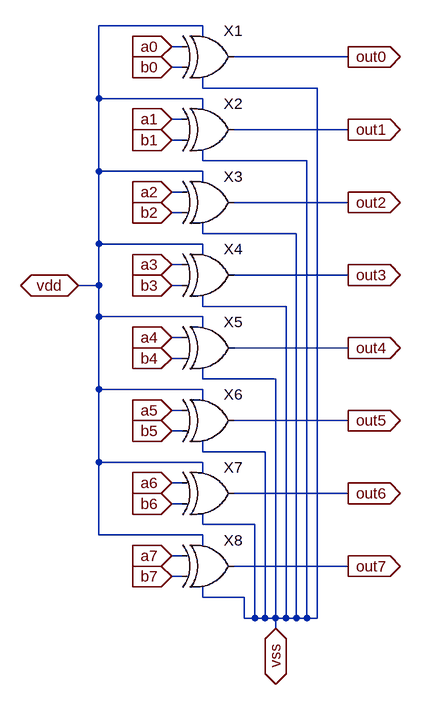
[diagram p0: schematic 8_bit_xor.asc]
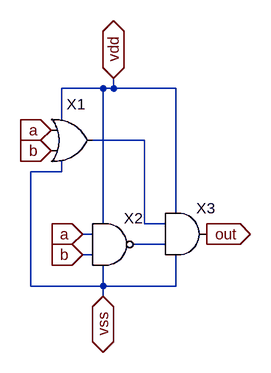
[diagram p1: sub-circuit xor.asc]
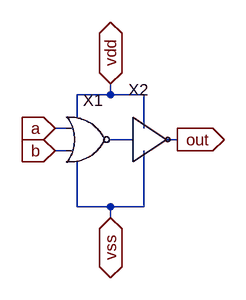
[diagram p2: sub-circuit or.asc]
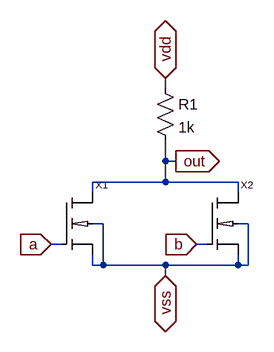
[diagram p3: sub-circuit nor.asc]
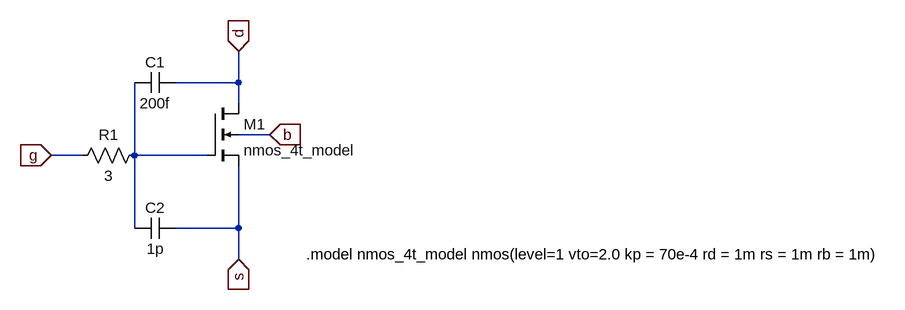
[diagram p4: sub-circuit nmos_4t.asc]
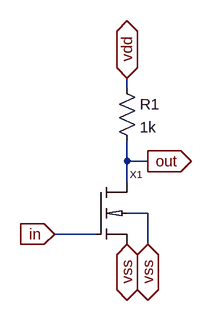
[diagram p5: sub-circuit not.asc]
8_bit_xor.asc, the LTspice schematic file:
Version 4
SHEET 1 880 992
WIRE 224 -32 64 -32
WIRE 224 -16 224 -32
WIRE 192 0 176 0
WIRE 448 16 272 16
WIRE 192 32 176 32
WIRE 224 64 224 48
WIRE 400 64 224 64
WIRE 64 80 64 -32
WIRE 224 80 64 80
WIRE 224 96 224 80
WIRE 192 112 176 112
WIRE 448 128 272 128
WIRE 192 144 176 144
WIRE 224 176 224 160
WIRE 384 176 224 176
WIRE 64 192 64 80
WIRE 224 192 64 192
WIRE 224 208 224 192
WIRE 192 224 176 224
WIRE 448 240 272 240
WIRE 192 256 176 256
WIRE 224 288 224 272
WIRE 368 288 224 288
WIRE 64 304 64 192
WIRE 224 304 64 304
WIRE 224 320 224 304
WIRE 192 336 176 336
WIRE 448 352 272 352
WIRE 64 368 64 304
WIRE 64 368 32 368
WIRE 192 368 176 368
WIRE 224 400 224 384
WIRE 352 400 224 400
WIRE 64 416 64 368
WIRE 224 416 64 416
WIRE 224 432 224 416
WIRE 192 448 176 448
WIRE 448 464 272 464
WIRE 192 480 176 480
WIRE 224 512 224 496
WIRE 336 512 224 512
WIRE 64 528 64 416
WIRE 224 528 64 528
WIRE 224 544 224 528
WIRE 192 560 176 560
WIRE 448 576 272 576
WIRE 192 592 176 592
WIRE 224 624 224 608
WIRE 320 624 224 624
WIRE 64 640 64 528
WIRE 224 640 64 640
WIRE 224 656 224 640
WIRE 192 672 176 672
WIRE 448 688 272 688
WIRE 192 704 176 704
WIRE 224 736 224 720
WIRE 304 736 224 736
WIRE 64 752 64 640
WIRE 224 752 64 752
WIRE 224 768 224 752
WIRE 192 784 176 784
WIRE 448 800 272 800
WIRE 192 816 176 816
WIRE 224 848 224 832
WIRE 288 848 224 848
WIRE 288 880 288 848
WIRE 304 880 304 736
WIRE 304 880 288 880
WIRE 320 880 320 624
WIRE 320 880 304 880
WIRE 336 880 336 512
WIRE 336 880 320 880
WIRE 352 880 352 400
WIRE 352 880 336 880
WIRE 368 880 368 288
WIRE 368 880 352 880
WIRE 384 880 384 176
WIRE 384 880 368 880
WIRE 400 880 400 64
WIRE 400 880 384 880
WIRE 336 896 336 880
FLAG 176 0 a0
IOPIN 176 0 In
FLAG 176 32 b0
IOPIN 176 32 In
FLAG 176 112 a1
IOPIN 176 112 In
FLAG 176 144 b1
IOPIN 176 144 In
FLAG 176 256 b2
IOPIN 176 256 In
FLAG 176 224 a2
IOPIN 176 224 In
FLAG 176 368 b3
IOPIN 176 368 In
FLAG 176 336 a3
IOPIN 176 336 In
FLAG 176 480 b4
IOPIN 176 480 In
FLAG 176 448 a4
IOPIN 176 448 In
FLAG 176 592 b5
IOPIN 176 592 In
FLAG 176 560 a5
IOPIN 176 560 In
FLAG 176 704 b6
IOPIN 176 704 In
FLAG 176 672 a6
IOPIN 176 672 In
FLAG 176 816 b7
IOPIN 176 816 In
FLAG 176 784 a7
IOPIN 176 784 In
FLAG 336 896 vss
IOPIN 336 896 BiDir
FLAG 32 368 vdd
IOPIN 32 368 BiDir
FLAG 448 16 out0
IOPIN 448 16 Out
FLAG 448 128 out1
IOPIN 448 128 Out
FLAG 448 240 out2
IOPIN 448 240 Out
FLAG 448 352 out3
IOPIN 448 352 Out
FLAG 448 464 out4
IOPIN 448 464 Out
FLAG 448 576 out5
IOPIN 448 576 Out
FLAG 448 688 out6
IOPIN 448 688 Out
FLAG 448 800 out7
IOPIN 448 800 Out
SYMBOL xor 240 -48 R0
SYMATTR InstName X1
SYMBOL xor 240 64 R0
SYMATTR InstName X2
SYMBOL xor 240 176 R0
SYMATTR InstName X3
SYMBOL xor 240 288 R0
SYMATTR InstName X4
SYMBOL xor 240 400 R0
SYMATTR InstName X5
SYMBOL xor 240 512 R0
SYMATTR InstName X6
SYMBOL xor 240 624 R0
SYMATTR InstName X7
SYMBOL xor 240 736 R0
SYMATTR InstName X8

xor.asc, the sub-circuit schematic file:
Version 4
SHEET 1 880 680
WIRE 208 -144 144 -144
WIRE 224 -144 224 -160
WIRE 224 -144 208 -144
WIRE 320 -144 224 -144
WIRE 144 -96 144 -144
WIRE 272 -64 192 -64
WIRE 144 -16 144 -32
WIRE 144 -16 96 -16
WIRE 320 48 320 -144
WIRE 208 64 208 -144
WIRE 272 64 272 -64
WIRE 304 64 272 64
WIRE 192 80 176 80
WIRE 304 96 256 96
WIRE 192 112 176 112
WIRE 96 160 96 -16
WIRE 208 160 208 128
WIRE 208 160 96 160
WIRE 320 160 320 112
WIRE 320 160 208 160
WIRE 208 176 208 160
FLAG 128 -80 a
IOPIN 128 -80 In
FLAG 176 80 a
IOPIN 176 80 In
FLAG 176 112 b
IOPIN 176 112 In
FLAG 128 -48 b
IOPIN 128 -48 In
FLAG 368 80 out
IOPIN 368 80 Out
FLAG 224 -160 vdd
IOPIN 224 -160 BiDir
FLAG 208 176 vss
IOPIN 208 176 BiDir
SYMBOL nand 224 32 R0
SYMATTR InstName X2
SYMBOL or 160 -128 R0
SYMATTR InstName X1
SYMBOL and 336 16 R0
SYMATTR InstName X3

or.asc, the sub-circuit schematic file:
Version 4
SHEET 1 880 680
WIRE 176 80 176 64
WIRE 176 80 128 80
WIRE 224 80 176 80
WIRE 128 112 128 80
WIRE 112 128 96 128
WIRE 224 128 224 80
WIRE 208 144 176 144
WIRE 272 144 256 144
WIRE 112 160 96 160
WIRE 128 240 128 176
WIRE 176 240 128 240
WIRE 224 240 224 160
WIRE 224 240 176 240
WIRE 176 256 176 240
FLAG 272 144 out
IOPIN 272 144 Out
FLAG 176 64 vdd
IOPIN 176 64 BiDir
FLAG 176 256 vss
IOPIN 176 256 BiDir
FLAG 96 128 a
IOPIN 96 128 In
FLAG 96 160 b
IOPIN 96 160 In
SYMBOL nor 144 80 R0
SYMATTR InstName X1
SYMBOL not 208 144 R0
SYMATTR InstName X2
SYMATTR Value ""

nor.asc, the sub-circuit schematic file:
Version 4
SHEET 1 880 680
WIRE 240 48 240 32
WIRE 240 160 240 128
WIRE 256 160 240 160
WIRE 240 192 240 160
WIRE 240 192 128 192
WIRE 352 192 240 192
WIRE 128 208 128 192
WIRE 352 208 352 192
WIRE 144 256 128 256
WIRE 368 256 352 256
WIRE 80 288 64 288
WIRE 304 288 288 288
WIRE 128 320 128 304
WIRE 144 320 144 256
WIRE 144 320 128 320
WIRE 240 320 144 320
WIRE 352 320 352 304
WIRE 352 320 240 320
WIRE 368 320 368 256
WIRE 368 320 352 320
WIRE 240 336 240 320
FLAG 240 32 vdd
IOPIN 240 32 BiDir
FLAG 240 336 vss
IOPIN 240 336 BiDir
FLAG 256 160 out
IOPIN 256 160 Out
FLAG 288 288 b
IOPIN 288 288 In
FLAG 64 288 a
IOPIN 64 288 In
SYMBOL res 224 32 R0
SYMATTR InstName R1
SYMATTR Value 1k
SYMBOL nmos_4t 80 208 R0
SYMATTR InstName X1
SYMBOL nmos_4t 304 208 R0
SYMATTR InstName X2

nmos_4t.asc, the sub-circuit schematic file:
Version 4
SHEET 1 880 680
WIRE -288 -224 -288 -272
WIRE -288 -224 -384 -224
WIRE -288 -192 -288 -224
WIRE -240 -144 -288 -144
WIRE -528 -112 -576 -112
WIRE -448 -112 -448 -224
WIRE -336 -112 -448 -112
WIRE -448 0 -448 -112
WIRE -288 0 -288 -96
WIRE -288 0 -384 0
WIRE -288 48 -288 0
FLAG -576 -112 g
IOPIN -576 -112 In
FLAG -288 -272 d
IOPIN -288 -272 In
FLAG -288 48 s
IOPIN -288 48 In
FLAG -240 -144 b
IOPIN -240 -144 In
SYMBOL nmos4 -336 -192 R0
SYMATTR InstName M1
SYMATTR Value nmos_4t_model
SYMBOL cap -384 -240 R90
WINDOW 0 0 32 VBottom 2
WINDOW 3 32 32 VTop 2
SYMATTR InstName C1
SYMATTR Value 200f
SYMBOL cap -384 -16 R90
WINDOW 0 0 32 VBottom 2
WINDOW 3 32 32 VTop 2
SYMATTR InstName C2
SYMATTR Value 1p
SYMBOL res -432 -128 R90
WINDOW 0 0 56 VBottom 2
WINDOW 3 32 56 VTop 2
SYMATTR InstName R1
SYMATTR Value 3
TEXT -184 40 Left 2 !.model nmos_4t_model nmos(level=1 vto=2.0 kp = 70e-4 rd = 1m rs = 1m rb = 1m)

not.asc, the sub-circuit schematic file:
Version 4
SHEET 1 880 680
WIRE 176 -96 176 -112
WIRE 176 16 176 -16
WIRE 208 16 176 16
WIRE 176 48 176 16
WIRE 208 96 176 96
WIRE 128 128 64 128
WIRE 208 144 208 96
FLAG 64 128 in
IOPIN 64 128 In
FLAG 176 144 vss
IOPIN 176 144 BiDir
FLAG 176 -112 vdd
IOPIN 176 -112 BiDir
FLAG 208 16 out
IOPIN 208 16 Out
FLAG 208 144 vss
IOPIN 208 144 BiDir
SYMBOL res 160 -112 R0
SYMATTR InstName R1
SYMATTR Value 1k
SYMBOL nmos_4t 128 48 R0
SYMATTR InstName X1

The netlist it stands for:
* 8_bit_xor.asc
XX1 a0 b0 vdd vss out0 xor
XX2 a1 b1 vdd vss out1 xor
XX3 a2 b2 vdd vss out2 xor
XX4 a3 b3 vdd vss out3 xor
XX5 a4 b4 vdd vss out4 xor
XX6 a5 b5 vdd vss out5 xor
XX7 a6 b6 vdd vss out6 xor
XX8 a7 b7 vdd vss out7 xor

* block symbol definitions
.subckt xor a b vdd vss out
XX2 a b vdd vss N002 nand  ; pins a b vdd vss out
XX1 a b N001 vdd vss or
XX3 N001 N002 vdd vss out and  ; pins a b vdd vss out
.ends xor

.subckt or a b out vdd vss
XX1 a b vdd vss N001 nor
XX2 N001 out vss vdd not
.ends or

.subckt nor a b vdd vss out
R1 vdd out 1k
XX1 out a vss vss nmos_4t
XX2 out b vss vss nmos_4t
.ends nor

.subckt nmos_4t D G S B
M1 d N001 s b nmos_4t_model
C1 d N001 200f
C2 s N001 1p
R1 N001 g 3
.model nmos_4t_model nmos(level=1 vto=2.0 kp = 70e-4 rd = 1m rs = 1m rb = 1m)
.ends nmos_4t

.subckt not in out vss vdd
R1 vdd out 1k
XX1 out in vss vss nmos_4t
.ends not

.model NMOS NMOS
.model PMOS PMOS
.lib standard.mos
.backanno
.end